# Altium schematic sheet Voltage Source.SchDoc: Voltage Source
size A4; Author: DODANHLUONG; Revision: 1.0; SheetNumber: 3; SheetTotal: 6; ProjectTitle: KIT ARDUINO VERSION 1.0
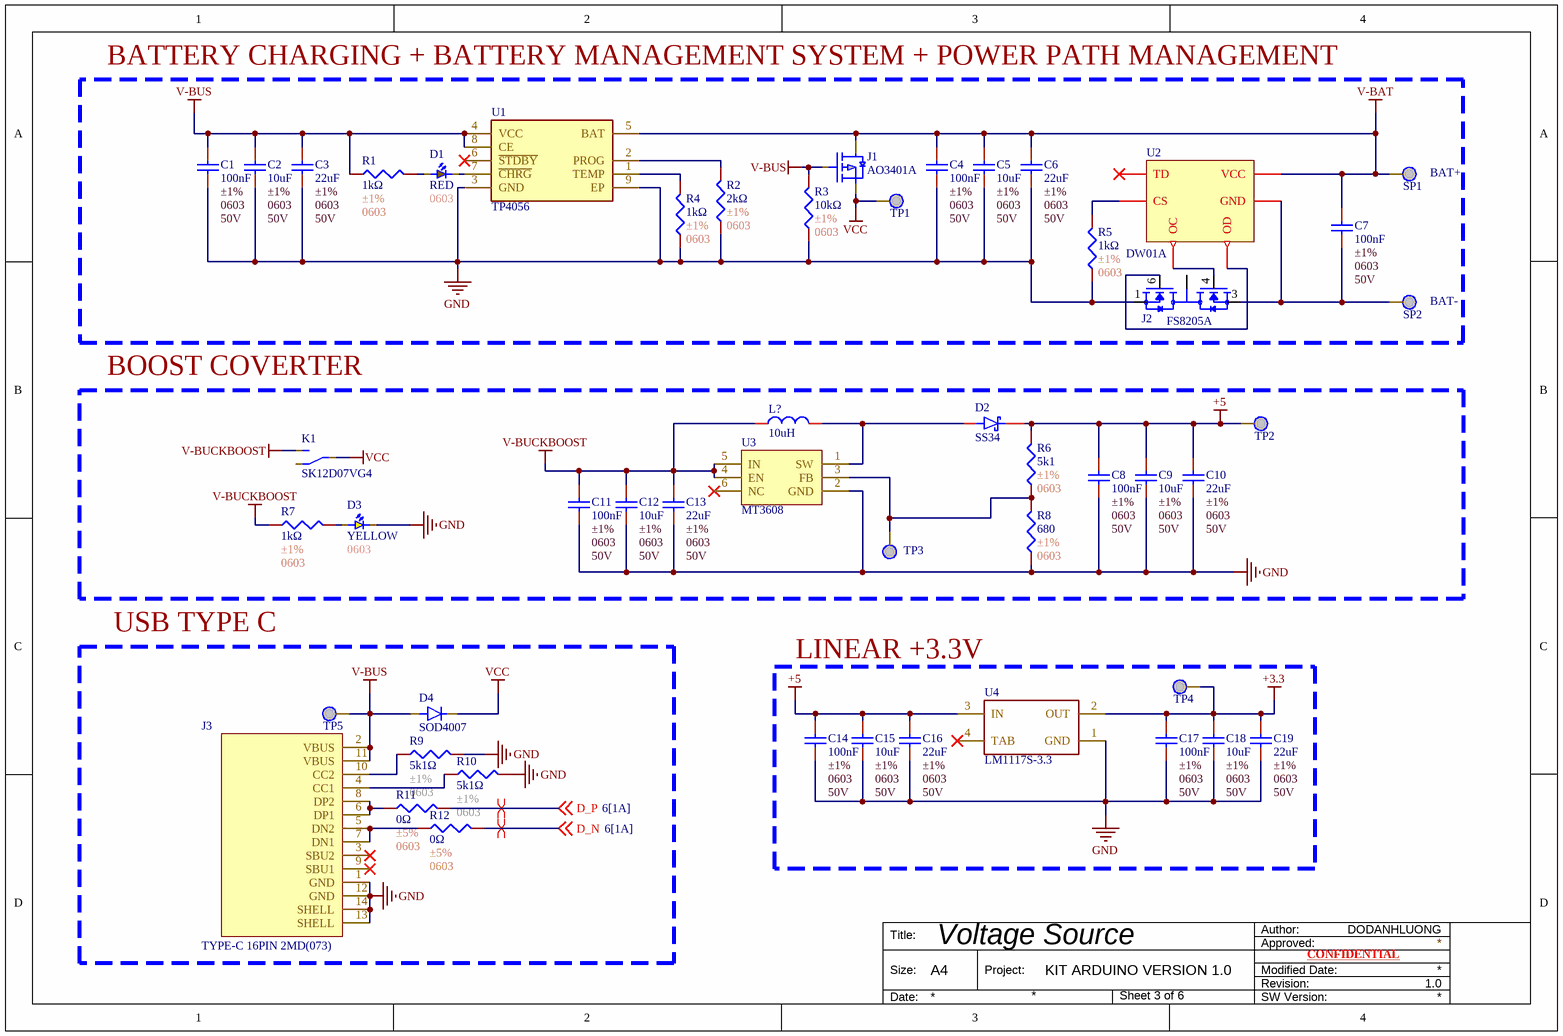
[diagram p0: Voltage Source.SchDoc]

## Parts
C1  100nF  Tolerance: ±1%  Package: 0603  Voltage Rating: 50V  [C0603]
C2  10uF  Tolerance: ±1%  Package: 0603  Voltage Rating: 50V  [C0603]
C3  22uF  Tolerance: ±1%  Package: 0603  Voltage Rating: 50V  [C0603]
C4  100nF  Tolerance: ±1%  Package: 0603  Voltage Rating: 50V  [C0603]
C5  10uF  Tolerance: ±1%  Package: 0603  Voltage Rating: 50V  [C0603]
C6  22uF  Tolerance: ±1%  Package: 0603  Voltage Rating: 50V  [C0603]
C7  100nF  Tolerance: ±1%  Package: 0603  Voltage Rating: 50V  [C0603]
C8  100nF  Tolerance: ±1%  Package: 0603  Voltage Rating: 50V  [C0603]
C9  10uF  Tolerance: ±1%  Package: 0603  Voltage Rating: 50V  [C0603]
C10  22uF  Tolerance: ±1%  Package: 0603  Voltage Rating: 50V  [C0603]
C11  100nF  Tolerance: ±1%  Package: 0603  Voltage Rating: 50V  [C0603]
C12  10uF  Tolerance: ±1%  Package: 0603  Voltage Rating: 50V  [C0603]
C13  22uF  Tolerance: ±1%  Package: 0603  Voltage Rating: 50V  [C0603]
C14  100nF  Tolerance: ±1%  Package: 0603  Voltage Rating: 50V  [C0603]
C15  10uF  Tolerance: ±1%  Package: 0603  Voltage Rating: 50V  [C0603]
C16  22uF  Tolerance: ±1%  Package: 0603  Voltage Rating: 50V  [C0603]
C17  100nF  Tolerance: ±1%  Package: 0603  Voltage Rating: 50V  [C0603]
C18  10uF  Tolerance: ±1%  Package: 0603  Voltage Rating: 50V  [C0603]
C19  22uF  Tolerance: ±1%  Package: 0603  Voltage Rating: 50V  [C0603]
D1  RED  Package: 0603  [LED0603]
D2  SS34  [SS34]
D3  YELLOW  Package: 0603  [LED0603]
D4  SOD4007  [SOD4007]
J1  AO3401A  [AO3401A]
J2  FS8205A  [FS8205A]
J3  TYPE-C 16PIN 2MD(073)  [TYPE_C_FAMALE]
K1  SK12D07VG4  [SK12D07VG4]
L?  10uH  [CD43]
R1  1kΩ  Tolerance: ±1%  Package: 0603  [R0603]
R2  2kΩ  Tolerance: ±1%  Package: 0603  [R0603]
R3  10kΩ  Tolerance: ±1%  Package: 0603  [R0603]
R4  1kΩ  Tolerance: ±1%  Package: 0603  [R0603]
R5  1kΩ  Tolerance: ±1%  Package: 0603  [R0603]
R6  5k1  Tolerance: ±1%  Package: 0603  [R0603]
R7  1kΩ  Tolerance: ±1%  Package: 0603  [R0603]
R8  680  Tolerance: ±1%  Package: 0603  [R0603]
R9  5k1Ω  Tolerance: ±1%  Package: 0603  [R0603]
R10  5k1Ω  Tolerance: ±1%  Package: 0603  [R0603]
R11  0Ω  Tolerance: ±5%  Package: 0603  [R0603]
R12  0Ω  Tolerance: ±5%  Package: 0603  [R0603]
SP1  BAT+  [SP]
SP2  BAT-  [SP]
TP1  TP  [TP]  (value not drawn)
TP2  TP  [TP]  (value not drawn)
TP3  TP  [TP]  (value not drawn)
TP4  TP  [TP]  (value not drawn)
TP5  TP  [TP]  (value not drawn)
U1  TP4056  [TP4056]
U2  DW01A  [DW01A]
U3  MT3608  [MT3608]
U4  LM1117S-3.3  [AMS1117-3.3]

## Blocks framed on the sheet
BOOST COVERTER: C8-C13 D2 D3 K1 L? R6-R8 TP2 TP3 U3
USB TYPE C: D4 J3 R9-R12 TP5
LINEAR +3.3V: C14-C19 TP4 U4

## Nets
+3.3: C17.1 C18.1 C19.1 TP4.1 U4.2(OUT)
+5: C8.1 C9.1 C10.1 C14.1 C15.1 C16.1 D2.1 R6.2 TP2.1 U4.3(IN)
GND: C1.2 C2.2 C3.2 C4.2 C5.2 C6.2 C8.2 C9.2 C10.2 C11.2 C12.2 C13.2 C14.2 C15.2 C16.2 C17.2 C18.2 C19.2 D3.1 J2.1(S1) J3.1(GND) J3.12(GND) J3.13(SHELL) J3.14(SHELL) R2.1 R3.1 R4.1 R5.1 R8.1 R9.2 R10.2 U1.3(GND) U1.9(EP) U3.2(GND) U4.1(GND)
V-BAT: C4.1 C5.1 C6.1 C7.1 J1.3(D) SP1.1 U1.5(BAT) U2.5(VCC)
V-BUCKBOOST: C11.1 C12.1 C13.1 K1.1 L?.1 R7.1 U3.4(EN) U3.5(IN)
V-BUS: C1.1 C2.1 C3.1 D4.2(A) J1.1(G) J3.2(VBUS) J3.11(VBUS) R1.1 R3.2 TP5.1 U1.4(VCC) U1.8(CE)
VCC: D4.1(C) J1.2(S) K1.2 TP1.1
D_N: R12.2 ; off-sheet D_N
D_P: R11.2 ; off-sheet D_P
NetC7_2: C7.2 J2.3(S2) SP2.1 U2.6(GND)
NetD1_1: D1.1 U1.7(~{CHRG})
NetD1_2: D1.2 R1.2
NetD2_2: D2.2 L?.2 U3.1(SW)
NetD3_2: D3.2 R7.2
NetJ2_2: J2.2(D12) J2.5(D12)
NetJ2_4: J2.4(G2) U2.3(OC)
NetJ2_6: J2.6(G1) U2.1(OD)
NetJ3_4: J3.4(CC1) R10.1
NetJ3_5: J3.5(DN2) J3.7(DN1) R12.1
NetJ3_6: J3.6(DP1) J3.8(DP2) R11.1
NetJ3_10: J3.10(CC2) R9.1
NetR2_2: R2.2 U1.2(PROG)
NetR4_2: R4.2 U1.1(TEMP)
NetR5_2: R5.2 U2.2(CS)
NetR6_1: R6.1 R8.2 TP3.1 U3.3(FB)

Not connected (* = marked no-connect by the designer): J3 3(SBU2)* 9(SBU1)*; K1 3; U1 6(~{STDBY})*; U2 4(TD)*; U3 6(NC)*; U4 4(TAB)*

## Layout directives
differential pair: D_N, D_P

## Notes on the sheet
- BATTERY CHARGING + BATTERY MANAGEMENT SYSTEM + POWER PATH MANAGEMENT
- Author:
- Title:
- Size:
- A4
- Project:
- Approved:
- Revision:
- Modified Date:
- CONFIDENTIAL
- Date:
- SW Version:

## Library data of the parts
C1 C4 C7 C8 C11 C14 C17 = C0603_100nF_±1%: 50V 10pF NP0 ±1% 0402 Multilayer Ceramic Capacitors MLCC - SMD/SMT ROHS; Manufacturer: YAGEO; Mfr. Part #: CC0402FRNPO9BN100; LCSC Part #: C513681; Link: https://www.lcsc.com/product-detail/C513681.html?s_z=n_capital%2520yageo%252010pF%25200402; Capacitance: 100nF
C2 C5 C9 C12 C15 C18 = C0603_10uF_±1%: 50V 10pF NP0 ±1% 0402 Multilayer Ceramic Capacitors MLCC - SMD/SMT ROHS; Manufacturer: YAGEO; Mfr. Part #: CC0402FRNPO9BN100; LCSC Part #: C513681; Link: https://www.lcsc.com/product-detail/C513681.html?s_z=n_capital%2520yageo%252010pF%25200402; Capacitance: 10uF
C3 C6 C10 C13 C16 C19 = C0603_22uF_±1%: 50V 10pF NP0 ±1% 0402 Multilayer Ceramic Capacitors MLCC - SMD/SMT ROHS; Manufacturer: YAGEO; Mfr. Part #: CC0402FRNPO9BN100; LCSC Part #: C513681; Link: https://www.lcsc.com/product-detail/C513681.html?s_z=n_capital%2520yageo%252010pF%25200402; Capacitance: 22uF
D1 = D0603_RED: 25mcd~40mcd Water Clear -40℃~+85℃ 624nm Red 120° 60mW 0402 LED Indication - Discrete ROHS; Manufacturer: XINGLIGHT; Mfr. Part #: XL-1005UGC; Voltage - Forward(Vf): 3V; LCSC Part #: C965793; Power(Watts): 60mW; Link: https://www.lcsc.com/product-detail/C136765.html?s_z=n_LED%25200402%2520RED; Illumination Color: RED
D2 = SS34: 40V Independent 3A 550mV@3A SMA(DO-214AC) Schottky Diodes ROHS; Manufacturer: MDD(Microdiode Semiconductor); Mfr. Part #: SS34; LCSC Part #: C8678; Package: SMA(DO-214AC); Voltage - DC Reverse(Vr): 40V; Current - Rectified: 3A; Link: https://www.lcsc.com/product-detail/C8678.html?s_z=n_SS34
D3 = D0603_YELLOW: 25mcd~40mcd Water Clear -40℃~+85℃ 624nm Red 120° 60mW 0402 LED Indication - Discrete ROHS; Manufacturer: XINGLIGHT; Mfr. Part #: XL-1005UGC; Voltage - Forward(Vf): 3V; LCSC Part #: C965793; Power(Watts): 60mW; Link: https://www.lcsc.com/product-detail/C136765.html?s_z=n_LED%25200402%2520RED; Illumination Color: YELLOW
D4 = SOD4007: 1A Independent 1kV 1.1V@1A SOD-123FL Diodes - General Purpose ROHS; Manufacturer: MDD(Microdiode Semiconductor); Mfr. Part #: SOD4007; Package: SOD-123FL; LCSC Part #: C18124; Link: https://www.lcsc.com/product-detail/C18124.html?s_z=n_SOD4007; Voltage - DC Reverse(Vr): 1kV; Current - Rectified: 1A
J1 = AO3401: 30V 4A 900mV@250uA 1 P-Channel SOT-23 MOSFETs ROHS; Manufacturer: AOS; Mfr. Part #: AO3401A; LCSC Part #: C15127; Package: SOT-23; Current - Continuous Drain(Id): 4A; Drain to Source Voltage: 30V; Link: https://www.lcsc.com/product-detail/C15127.html?s_z=n_AO3401
J2 = FS8205A: 20V 9A 31.5mΩ@2.5V 1.5W 1.2V@250uA SOT-23-6 MOSFETs ROHS; Manufacturer: TECH PUBLIC; Mfr. Part #: FS8205A; Package: SOT-23-6; LCSC Part #: C2830320; Drain to Source Voltage: 20V; Current - Continuous Drain(Id): 9A; Link: https://www.lcsc.com/product-detail/C2830320.html?s_z=n_fs8205a
J3 = TYPE_C_FAMALE_16PIN: 3A 1 Surface Mount, Right Angle 16P Female -25℃~+85℃ Type-C SMD USB Connectors ROHS; Manufacturer: SHOU HAN; Mfr. Part #: TYPE-C 16PIN 2MD(073); LCSC Part #: C2765186; Package: SMD; Number of Contacts: 16P; Link: https://www.lcsc.com/product-detail/C2765186.html?s_z=n_type%2520c
K1 = SK12D07VG4: 500mA SPDT 50V 5,000 Cycles Through Hole Slide Switches ROHS; Manufacturer: SHOU HAN; Switch Height: 8.8mm; Mfr. Part #: SK12D07VG4; LCSC Part #: C393937; Package: Through Hole; Link: https://www.lcsc.com/product-detail/C393937.html?s_z=n_SK12D07VG4
L? = CD4-10UH: 1.15A 10uH Unshielded Inductor ±20% SMD,4x4.5mm Power Inductors ROHS; Manufacturer: ZE; Mfr. Part #: CD43-100M; Key Attributes: FIXED IND 10uH 1.15A 182mΩ SMD,4x4.5mm; DC Resistance(DCR): 182mΩ; LCSC Part #: C18734467; Package: SMD,4x4.5mm; Link: https://www.lcsc.com/product-detail/C18734467.html?s_z=n_CD43%252010uH; Tolerance: ±20%; Current Rating: 1.15A; Inductance: 10uH
R1 R4 R5 R7 = R0603_1kΩ_±1%: 62.5mW Thick Film Resistor 50V ±1% ±200ppm/℃ 10Ω 0402 Chip Resistor - Surface Mount ROHS; Manufacturer: YAGEO; Mfr. Part #: RC0402FR-0710RL; LCSC Part #: C138066; Resistance: 1kΩ; Link: https://www.lcsc.com/product-detail/C138066.html?s_z=n_resistor%25200402%252010R
R2 = R0603_2kΩ_±1%: 62.5mW Thick Film Resistor 50V ±1% ±200ppm/℃ 10Ω 0402 Chip Resistor - Surface Mount ROHS; Manufacturer: YAGEO; Mfr. Part #: RC0402FR-0710RL; LCSC Part #: C138066; Resistance: 2kΩ; Link: https://www.lcsc.com/product-detail/C138066.html?s_z=n_resistor%25200402%252010R
R3 = R0603_10kΩ_±1%: 62.5mW Thick Film Resistor 50V ±1% ±200ppm/℃ 10Ω 0402 Chip Resistor - Surface Mount ROHS; Manufacturer: YAGEO; Mfr. Part #: RC0402FR-0710RL; LCSC Part #: C138066; Resistance: 10kΩ; Link: https://www.lcsc.com/product-detail/C138066.html?s_z=n_resistor%25200402%252010R
R6 = R0603_10kΩ_±1%: 62.5mW Thick Film Resistor 50V ±1% ±200ppm/℃ 10Ω 0402 Chip Resistor - Surface Mount ROHS; Manufacturer: YAGEO; Mfr. Part #: RC0402FR-0710RL; Resistance: 10kΩ; LCSC Part #: C138066; Link: https://www.lcsc.com/product-detail/C138066.html?s_z=n_resistor%25200402%252010R
R8 = R0603_2kΩ_±1%: 62.5mW Thick Film Resistor 50V ±1% ±200ppm/℃ 10Ω 0402 Chip Resistor - Surface Mount ROHS; Manufacturer: YAGEO; Mfr. Part #: RC0402FR-0710RL; Resistance: 2kΩ; LCSC Part #: C138066; Link: https://www.lcsc.com/product-detail/C138066.html?s_z=n_resistor%25200402%252010R
R9 R10 = R0603_5k1Ω_±1%: 100mW Thick Film Resistor 75V ±100ppm/℃ ±1% 5.1kΩ 0603 Chip Resistor - Surface Mount ROHS; Manufacturer: FOJAN; Mfr. Part #: FRC0603F5101TS; Key Attributes: RES 5.1kΩ ±1% 100mW 0603; LCSC Part #: C2907044; Link: https://www.lcsc.com/product-detail/C2907044.html?s_z=n_5k1%25200603; Resistance: 5k1Ω
R11 R12 = R0603_0Ω_±5%: 100mW Thick Film Resistor 75V ±5% 0Ω 0603 Chip Resistor - Surface Mount ROHS; Manufacturer: YAGEO; Mfr. Part #: RC0603JR-070RL; Key Attributes: RES 0Ω ±5% 100mW 0603; LCSC Part #: C95177; Resistance: 0Ω; Link: https://www.lcsc.com/product-detail/C138066.html?s_z=n_resistor%25200402%252010R
SP1 SP2 = SP
U1 = TP4056: 4V~6V Lithium-ion/Polymer 1 ESOP-8 Battery Management ROHS; Manufacturer: TPOWER; Key Attributes: 1A Lithium Battery Charger; Number of Cells: 1; Charging Saturation Voltage: 4.2V; Mfr. Part #: TP4056; LCSC Part #: C382139; Package: ESOP-8; Voltage - Supply: 4V~6V; Link: https://www.lcsc.com/product-detail/C382139.html?s_z=n_TP4056
U2 = DW01A: 1.5V~8V Lithium-ion/Polymer 1 SOT-23-6 Battery Management ROHS; Manufacturer: YONGYUTAI; Key Attributes: Lithium battery protection circuit; Charging Saturation Voltage: 4.3V; Mfr. Part #: DW01A; LCSC Part #: C2927799; Package: SOT-23-6; Voltage - Supply: 1.5V~8V; Link: https://www.lcsc.com/product-detail/C2927799.html?s_z=n_DW-01A
U3 = MT3608: Boost Adjustable 2A 2V~24V SOT-23-6 DC-DC Converters ROHS; Manufacturer: XI'AN Aerosemi Tech; Frequency - Switching: 1.2MHz; Mfr. Part #: MT3608; LCSC Part #: C84817; Package: SOT-23-6; Function: Boost; Link: https://www.lcsc.com/product-detail/C84817.html?s_z=n_mt3608
U4 = LM1117S-3.3: 75dB@(120Hz) 1A Fixed 3.3V Positive 12V SOT-223-3 Voltage Regulators - Linear, Low Drop Out (LDO) Regulators ROHS; Manufacturer: HTC; Noise: 100uV; Mfr. Part #: LM1117S-3.3; LCSC Part #: C126027; Package: SOT-223-3; Output Current: 1A; Voltage - Supply: 12V; Link: https://www.lcsc.com/product-detail/C126027.html?s_z=n_lm1117-33